# Altium schematic sheet phase_current_sense.SchDoc
size Letter
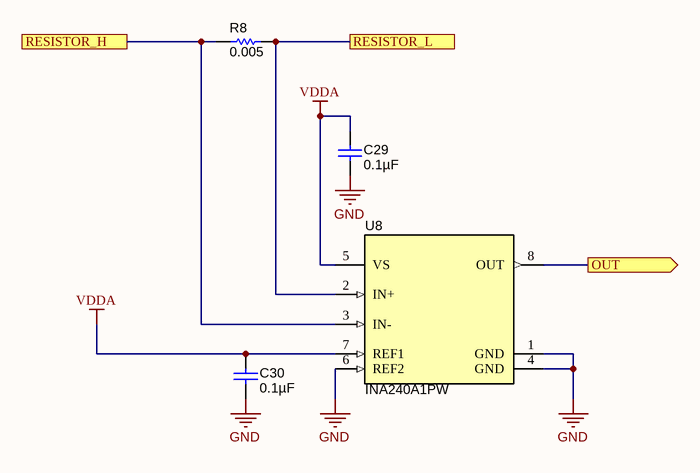
[diagram p0: phase_current_sense.SchDoc]

## Parts
C29  ValueDisplayed: 0.1µF  [CAP_0402]  (hidden comment: GCM155R71C104KA55D)
C30  ValueDisplayed: 0.1µF  [CAP_0402]  (hidden comment: GCM155R71C104KA55D)
R8  ValueDisplayed: 0.005  [CRE2512-R5_R9]  (hidden comment: CRE2512-FZ-R005E-3)
U8  INA240A1PW  [PW0008A_N]

## Ports
OUT (out), RESISTOR_H, RESISTOR_L

## Nets
GND: C29.1 C30.1 U8.1(GND) U8.4(GND) U8.6(REF2)
VDDA: C29.2 C30.2 U8.5(VS) U8.7(REF1)
OUT: U8.8(OUT) ; port OUT
RESISTOR_H: R8.1 U8.3(IN-) ; port RESISTOR_H
RESISTOR_L: R8.2 U8.2(IN+) ; port RESISTOR_L

## Library data of the parts
C29 C30 = GCM155R71C104KA55D: CAP, CERM, 0.1 µF, 16 V, +/- 10%, X7R, 0402; Manufacturer: MuRata; Polarized: N; CompType: Capacitor; Value: 0.1uF; U/M: EA; Cap_F: 0.0000001; Tolerance_%: 10; Value1: Unknown; VDC_V: 16; Value2: 16V; TaMin_C: -55; TaMax_C: 125; Cap_Case: 0402; AEC Category: Q200; SymbolVersion: 2008-07-09; PartNumber: GCM155R71C104KA55D; PackageReference: 0402; RoHS: Y; MountType: SMT; Technology: Ceramic; TempCo: X7R; Published: 2008-06-19; Publisher: Texas Instruments; LatestRevisionDate: 2016-03-12; ComponentLink1Description: Datasheet link; ComponentLink1URL: http://psearch.murata.com/capacitor/product/GCM155R71C104KA55%23.pdf; Supplier 1: Digi-Key; Supplier Part Number 1: 490-4759-2-ND; AEC Qualified: ?
R8 = CRE2512-FZ-R005E-3: RES, 0.005, 1%, 3 W, AEC-Q200 Grade 0, 2512; Manufacturer: Bourns; CompType: Resistor; Value: 0.005; Value_Code: 5L000; Tolerance_%: 1; Power_W: 3; Value2: 3W; TempCo: 75 ppm/C; EIA_Code: E96; U/M: EA; AEC Category: Q200; AEC Qualified: Y; AEC Grade: 0; SizeArea_mm2: 21.6075; SizeX_mm: 6.45; SizeY_mm: 3.35; SizeZ_mm: 0.9; SymbolVersion: 2009-05-29; PartNumber: CRE2512-FZ-R005E-3; PackageReference: 2512; RoHS: Y; Res_ohm: 0.005; Value1: 1%; MountType: SMT; Technology: Metal Film; Published: 2008-06-26; Publisher: Texas Instruments; LatestRevisionDate: 2016-06-02; ComponentLink1Description: Datasheet link; ComponentLink1URL: http://www.bourns.com/docs/Product-Datasheets/CRE.pdf; Supplier 1: Digi-Key; Supplier Part Number 1: CRE2512-FZ-R005E-3CT-ND; Supplier 2: Mouser; Supplier Part Number 2: 652-CRE2512FZR005E-3; Supplier 3: Farnell; Supplier Part Number 3: 2434014
U8 = INA240A1PW: Wide Common-Mode Range, Voltage Output, High or Low-Side Bi-Directional Zero-Drift Current Shunt Monitor, PW0008A; Manufacturer: Texas Instruments; SymbolCreator: Altium; CompType: IC; U/M: EA; SymbolVersion: 2016-01-07; PartNumber: INA240A1PW; PackageReference: PW0008A; MountType: SMT; ComponentLink1Description: Datasheet Link; ComponentLink1URL: https://sps06.itg.ti.com/sites/KMS/crossdivteams/altium/docs/ComponentDatasheets/INA240 Prelim DS - 9-15-15.pdf; Publisher: Texas Instruments; LatestRevisionDate: 2016-03-14; Alternate Manufacturer: Texas Instruments